# Altium schematic sheet Charger.SchDoc
size A4
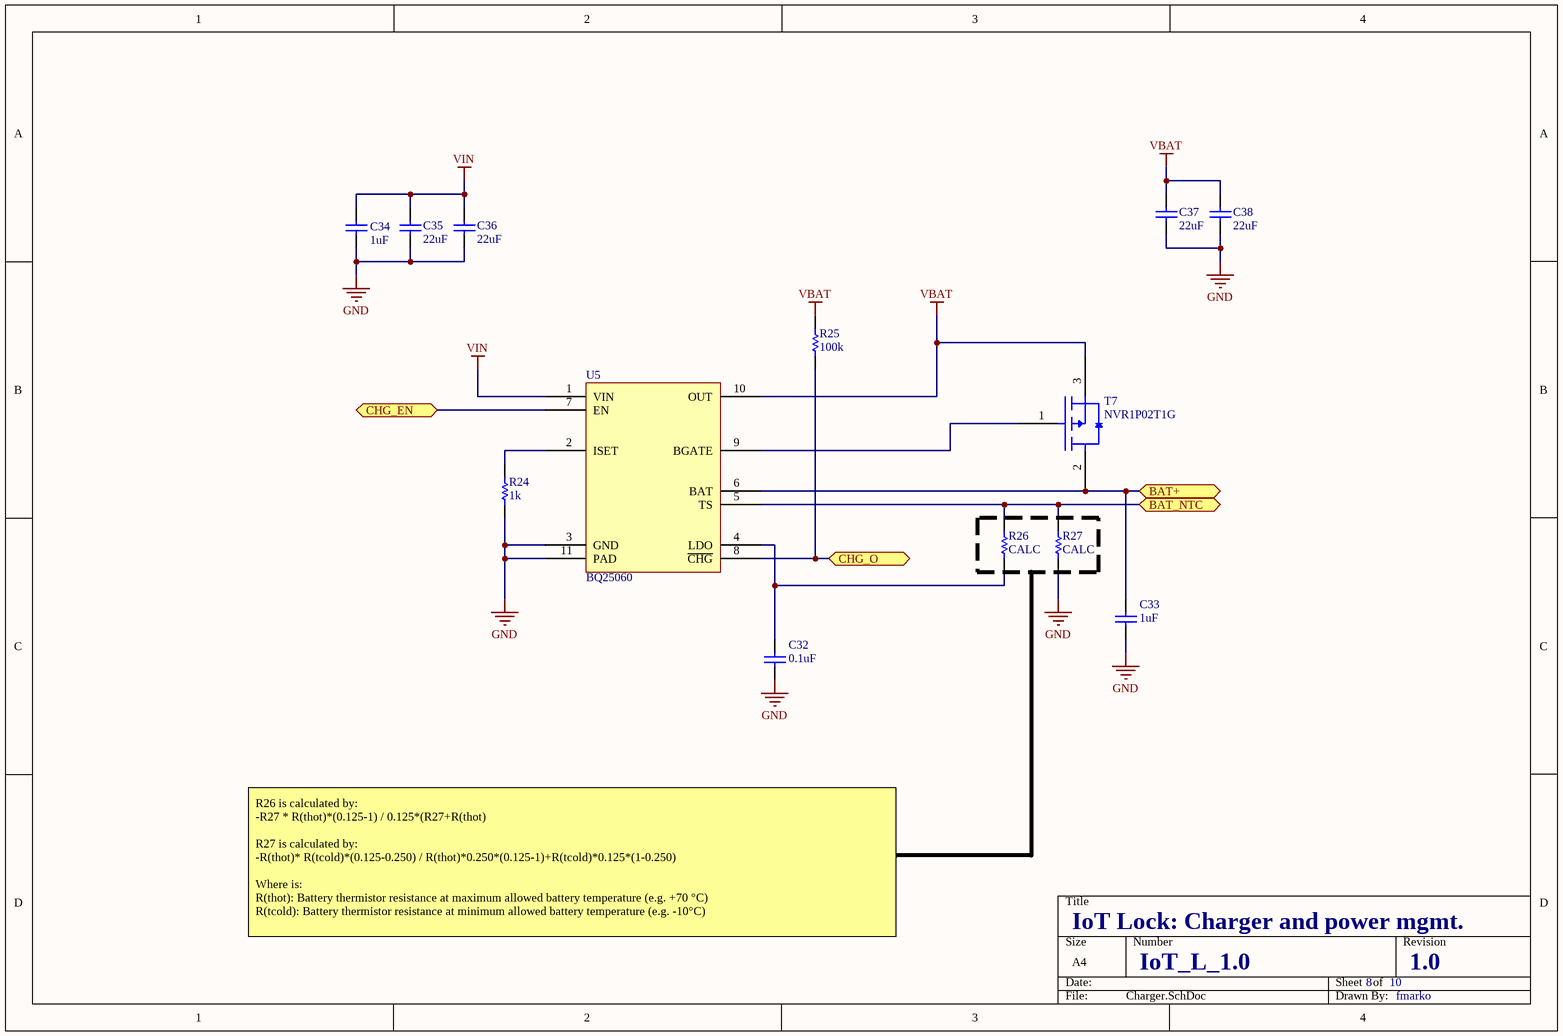
[diagram p0: Charger.SchDoc]

## Parts
C32  value 0.1uF  [0402]  (hidden comment: GRM1555C1HR50BA01D)
C33  value 1uF  [0402]  (hidden comment: GRM1555C1HR50BA01D)
C34  value 1uF  [0402]  (hidden comment: GRM1555C1HR50BA01D)
C35  value 22uF  [1608[0603]]  (hidden comment: GRM1555C1HR50BA01D)
C36  value 22uF  [1608[0603]]  (hidden comment: GRM1555C1HR50BA01D)
C37  value 22uF  [1608[0603]]  (hidden comment: GRM1555C1HR50BA01D)
C38  value 22uF  [1608[0603]]  (hidden comment: GRM1555C1HR50BA01D)
R24  value 1k  [0402]  (hidden comment: Res Semi)
R25  value 100k  [0402]  (hidden comment: Res Semi)
R26  value CALC  [0402]  (hidden comment: Res Semi)
R27  value CALC  [0402]  (hidden comment: Res Semi)
T7  NVR1P02T1G  [SOT95P237X111-3N]
U5  BQ25060  [SON50P200X80_HS-11N]

## Ports
BAT+, BAT_NTC, CHG_EN, CHG_O

## Nets
GND: C32.1 C33.1 C34.1 C35.1 C36.1 C37.1 C38.1 R24.1 R27.1 U5.3(GND) U5.11(PAD)
VBAT: C37.2 C38.2 R25.2 T7.3(D) U5.10(OUT)
VIN: C34.2 C35.2 C36.2 U5.1(VIN)
BAT+: C33.2 T7.2(S) U5.6(BAT) ; port BAT+
BAT_NTC: R26.2 R27.2 U5.5(TS) ; port BAT_NTC
CHG_EN: U5.7(EN) ; port CHG_EN
CHG_O: R25.1 U5.8(~{CHG}) ; port CHG_O
NetC32_2: C32.2 R26.1 U5.4(LDO)
NetR24_2: R24.2 U5.2(ISET)
NetT7_1: T7.1(G) U5.9(BGATE)

## Notes on the sheet
- R26 is calculated by:
  -R27 * R(thot)*(0.125-1) / 0.125*(R27+R(thot)
  R27 is calculated by:
  -R(thot)* R(tcold)*(0.125-0.250) / R(thot)*0.250*(0.125-1)+R(tcold)*0.125*(1-0.250)
  Where is:
  R(thot): Battery thermistor resistance at maximum allowed battery temperature (e.g. +70 °C)
  R(tcold): Battery thermistor resistance at minimum allowed battery temperature (e.g. -10°C)
  Check your battery specifications/datasheet
- IoT Lock: Charger and power mgmt.
- IoT_L_1.0
- 8
- 10
- 1.0
- fmarko

## Library data of the parts
C32-C38 = Cap: Capacitor; Published: 8-Jun-2000; LatestRevisionDate: 17-Jul-2002; LatestRevisionNote: Re-released for DXP Platform.; PackageReference: RAD-0.3; Publisher: Altium Limited; PackageDescription: Radial Cap, Thru-Hole; 2 Leads; 0.3 in Pin Spacing
R24-R27 = Res Semi: Semiconductor Resistor; Published: 8-Jun-2000; LatestRevisionDate: 17-Jul-2002; LatestRevisionNote: Re-released for DXP Platform.; PackageReference: AXIAL-0.5; Publisher: Altium Limited; PackageDescription: Axial Device, Thru-Hole; 2 Leads; 0.5 in Pin Spacing
T7 = NVR1P02T1G: P-Channel MOSFET
U5 = BQ25060: Li-Ion standalone charger, TI